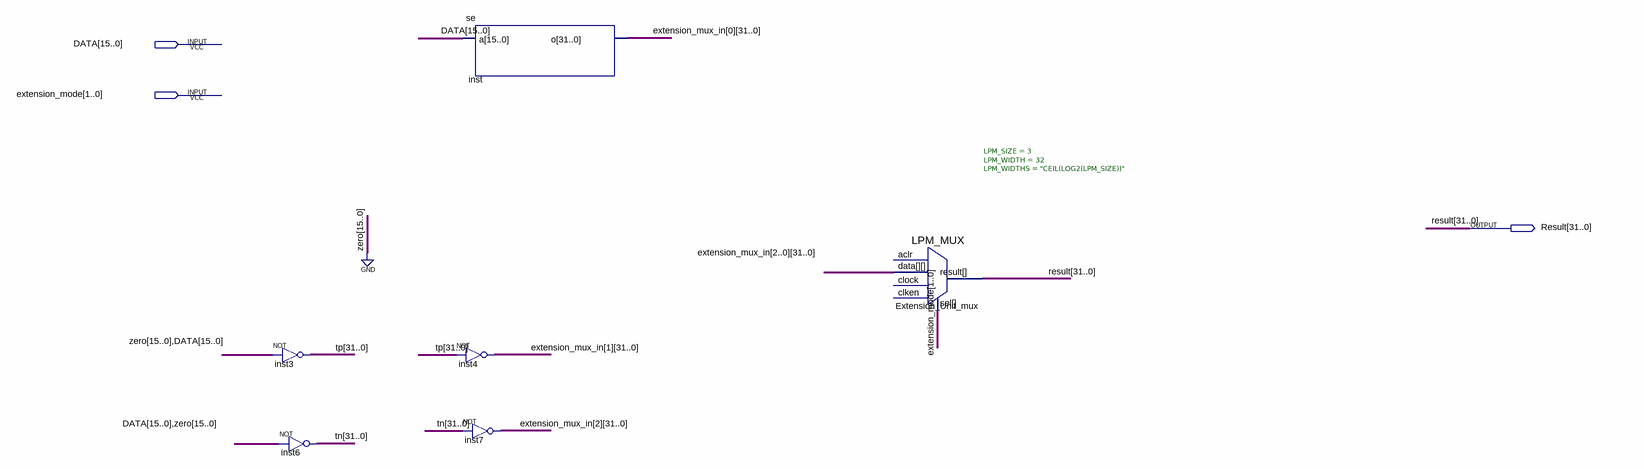
[diagram p0: schematic sheet]
// Quartus schematic Extension_Unit.bdf as structural Verilog: 6 symbols, 3 pins
module Extension_Unit (
  input  [15:0] DATA,
  input  [1:0] extension_mode,
  output [31:0] Result
);

  wire [31:0] extension_mux_in_0, extension_mux_in_1, extension_mux_in_2, tn, tp;

  assign tp = ~{{16{1'b0}}, DATA};  // NOT inst3, 32 bits wide
  assign tn = ~{DATA, {16{1'b0}}};  // NOT inst6, 32 bits wide
  se inst (.a(DATA), .o(extension_mux_in_0));
  assign extension_mux_in_1 = ~tp;  // NOT inst4, 32 bits wide
  assign extension_mux_in_2 = ~tn;  // NOT inst7, 32 bits wide
  LPM_MUX #(.LPM_SIZE(3), .LPM_WIDTH(32), .LPM_WIDTHS("CEIL(LOG2(LPM_SIZE))")) Extension_Unit_mux (
    .data({extension_mux_in_2, extension_mux_in_1, extension_mux_in_0}), .sel(extension_mode), .result(Result));  // open: clock, aclr, clken
endmodule
